# Altium schematic sheet RS485.SchDoc: RP2040 CNC
size B; Author: AM; CompanyName: Expatria Technologies; DrawnBy: A.Marles; Engineer: AM; Organization: Expatria Technolgoies; DocumentNumber: 6; SheetNumber: 6; SheetTotal: 14
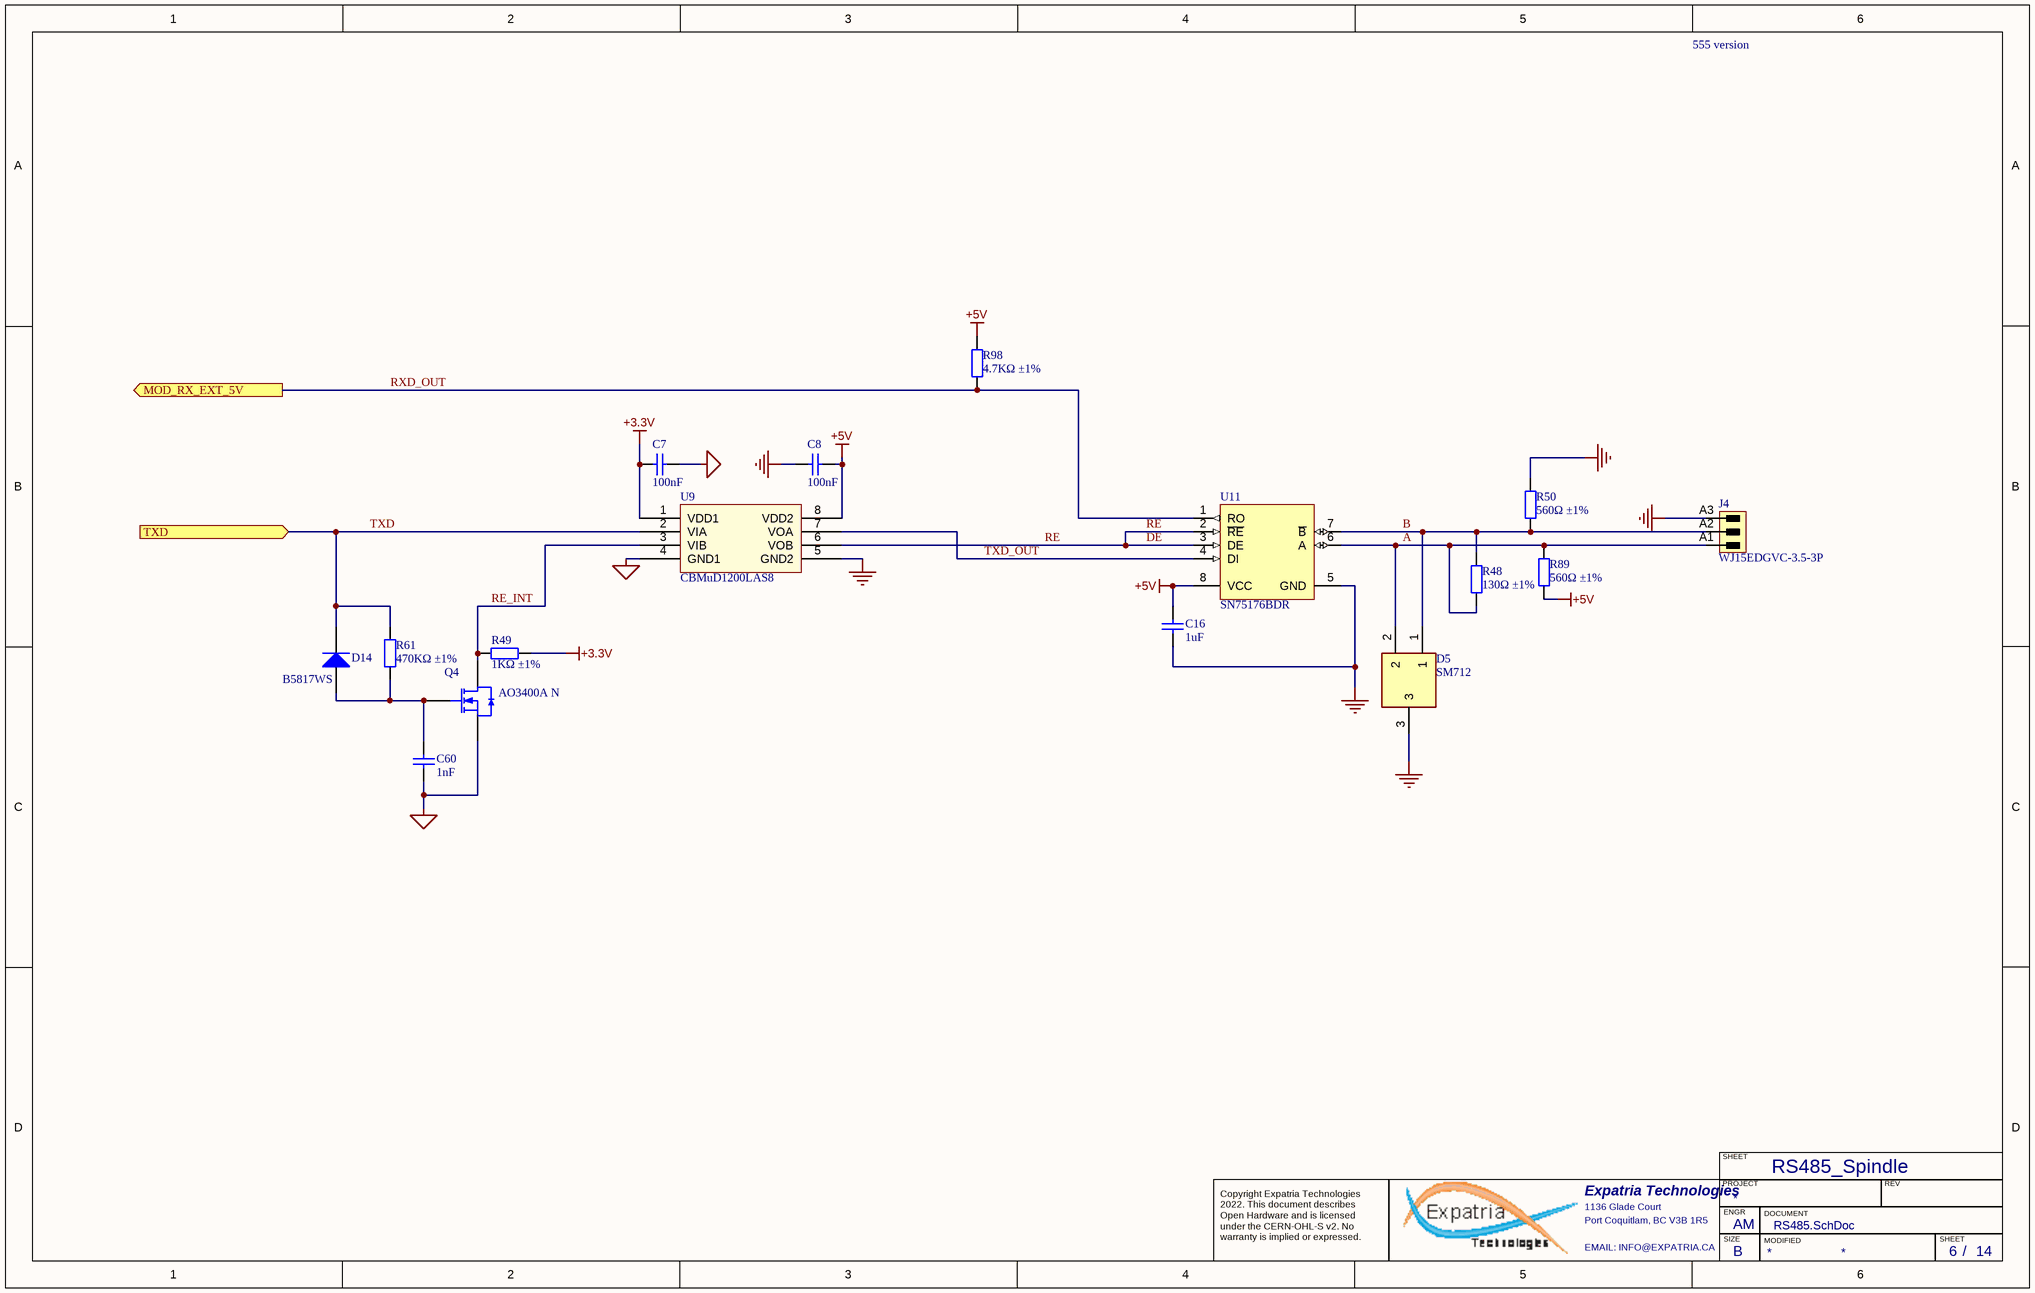
[diagram p0: RS485.SchDoc]

## Parts
C7  100nF  [0603_C]
C8  100nF  [0603_C]
C16  1uF  [0603_C]
C60  1nF  [0603_C]
D5  SM712  [SOT95P230X117-3N]
D14  B5817WS  [SOD-323]
J4  WJ15EDGVC-3.5-3P  [691321100003 - 3.5mm  3p]
Q4  AO3400A N  [SOT-23-3L]
R48  130Ω ±1%  [0603_R]
R49  1KΩ ±1%  [0603_R]
R50  560Ω ±1%  [0603_R]
R61  470KΩ ±1%  [0603_R]
R89  560Ω ±1%  [0603_R]
R98  4.7KΩ ±1%  [0603_R]
U9  CBMuD1200LAS8  [SOIC-8_150mil]
U11  SN75176BDR  [SOIC-8_150mil]

## Ports
MOD_RX_EXT_5V (out), TXD (in)

## Nets
+3.3V: C7.1 R49.1 U9.1(VDD1)
+5V: C8.2 C16.2 R89.2 R98.2 U9.8(VDD2) U11.8(VCC)
GND: C8.1 C16.1 D5.3 J4.A3 R50.1 U9.5(GND2) U11.5(GND)
MCU_GND: C7.2 C60.2 Q4.2(S) U9.4(GND1)
A: D5.2 J4.A1 R48.1 R89.1 U11.6(A)
B: D5.1 J4.A2 R48.2 R50.2 U11.7(~{B})
DE: U9.6(VOB) U11.2(~{RE}) U11.3(DE)  [also labelled RE]
RE_INT: Q4.3(D) R49.2 U9.3(VIB)
RXD_OUT: R98.1 U11.1(RO) ; port MOD_RX_EXT_5V
TXD: D14.2(K) R61.1 U9.2(VIA) ; port TXD
TXD_OUT: U9.7(VOA) U11.4(DI)
NetC60_1: C60.1 D14.1(A) Q4.1(G) R61.2

## Notes on the sheet
- 555 version
- RS485_Spindle
- SHEET
- Expatria Technologies
- 1136 Glade Court
- Port Coquitlam, BC V3B 1R5
- PROJECT
- SIZE
- ENGR
- MODIFIED
- DOCUMENT
- REV
- Copyright Expatria Technologies 2022. This document describes Open Hardware and is licensed under the CERN-OHL-S v2. No warranty is implied or expressed.
- EMAIL: INFO@EXPATRIA.CA
- B
- /

## Library data of the parts
C7 C8 = 0603 100nF (104) 10% 50V: Chip capacitors; Manufacturer: YAGEO; PartNumber: CC0603KRX7R9BB104; Tolerance: 10%; Voltage: 50V; ComponentLink1Description: Supplier link; ComponentLink1URL: http://www.szlcsc.com/product/details_15331.html; Package: 0603; Supplier: LC; SuppliersPartNumber: C14663; Capacitance: 100nF
C16 = 0603 1uF (105) 10% 50V: Chip capacitors; Manufacturer: Samsung Electro-Mechanics; PartNumber: CL10A105KB8NNNC; Tolerance: 10%; Voltage: 50V; ComponentLink1Description: Supplier link; ComponentLink1URL: http://www.szlcsc.com/product/details_16531.html; Package: 0603; Supplier: LC; SuppliersPartNumber: C15849; Capacitance: 1uF
C60 = 0603 1nF (102) 10% 50V: Chip capacitors; Manufacturer: Samsung Electro-Mechanics; PartNumber: CL10B102KB8NNNC; Tolerance: 10%; Voltage: 50V; ComponentLink1Description: Supplier link; ComponentLink1URL: http://www.szlcsc.com/product/details_1940.html; Package: 0603; Supplier: LC; SuppliersPartNumber: C1588; Capacitance: 1nF
D5 = CDSOT23-SM712: Bidirectional 12V (Max), 7V (Max) 7.5V / 13.3V 10V / 20V 12A(8/20us) SOT-23-3 TVS RoHS; Manufacturer_Name: DOWO; Height: 1.17mm; Manufacturer_Part_Number: SM712; SuppliersPartNumber: C293966
D14 = SOD-123 B5819W  SL: 20V 750mV@3A 1A SOD-323 Schottky Barrier Diodes (SBD) ROHS; Package: SOD-323; Supplier: LC; SuppliersPartNumber: C699102
J4 = 3.5mm Terminal Header 3p: Header,Male Pin,Covered(4 Sided) 3 1 0.138"（3.50mm） 3 P=3.5mm Pluggable System Terminal Block RoHS; Manufacturer: Ningbo Kangnex Elec; Pitch_mm: 3.5 mm; UL_94_flammability_rating: V-0; Side_termination_characteristic: closed side; Solder_pin_length_mm: 3.2 mm; Short_text_for_material: SL 3.50/03/180G 3.2SN OR BX; Pitch_inch: 0.138 inch; PartNumber: WJ15EDGVC-3.5-3P; PackageReference: SL_3_50_180G_03; ComponentLink1URL: http://www.weidmueller.com/; ComponentLink1Description: Manufacturer URL; Packaging: Box; Revision: V1; SuppliersPartNumber: C192778; Manufacturer 1: Ningbo Kangnex Elec; Manufacturer Part Number 1: WJ15EDGVC-3.5-3P; Package: P=3.5mm
Q4 = AO3400A N道沟 X0YV1T SOT-23: MOS(场效应管); ComponentLink1Description: 供应商链接; ComponentLink1URL: http://www.szlcsc.com/product/details_21629.html; Package: SOT-23; Supplier: LC; SuppliersPartNumber: C20917
R48 = 0603 130R (1300) 1%: Chip resistor; Manufacturer: Uniroyal Elec; PartNumber: 0603WAF1300T5E; Power: 1/10W; ComponentLink1Description: Supplier link; ComponentLink1URL: http://www.szlcsc.com/product/details_23523.html; Package: 0603; Supplier: LC; SuppliersPartNumber: C22796; Resistance: 130Ω; Tolerance: 1%
R49 = 0603 1K (1001) 1%: Chip resistor; Manufacturer: Uniroyal Elec; PartNumber: 0603WAF1001T5E; Power: 1/10W; ComponentLink1Description: Supplier link; ComponentLink1URL: http://www.szlcsc.com/product/details_21904.html; Package: 0603; Supplier: LC; SuppliersPartNumber: C21190; Resistance: 1KΩ; Tolerance: 1%
R50 R89 = 0603 560R (5600) 1%: Chip resistor; Manufacturer: Uniroyal Elec; PartNumber: 0603WAF5600T5E; Power: 1/10W; ComponentLink1Description: Supplier link; ComponentLink1URL: http://www.szlcsc.com/product/details_23931.html; Package: 0603; Supplier: LC; SuppliersPartNumber: C23204; Resistance: 560Ω; Tolerance: 1%
R61 = 0603 470K (4703) 1%: Chip resistor; Manufacturer: Uniroyal Elec; PartNumber: 0603WAF4703T5E; Power: 1/10W; ComponentLink1Description: Supplier link; ComponentLink1URL: http://www.szlcsc.com/product/details_23905.html; Package: 0603; Supplier: LC; SuppliersPartNumber: C23178; Resistance: 470KΩ; Tolerance: 1%
R98 = 0603 4.7K (4701) 1%: Chip resistor; Manufacturer: Uniroyal Elec; PartNumber: 0603WAF4701T5E; Power: 1/10W; ComponentLink1Description: Supplier link; ComponentLink1URL: http://www.szlcsc.com/product/details_23889.html; Package: 0603; Supplier: LC; SuppliersPartNumber: C23162; Resistance: 4.7KΩ; Tolerance: 1%
U9 = CBMuD1200LAS8: Dual Channel Isolator; Package: SOIC-8_150mil; Supplier: LC; SuppliersPartNumber: C476470; ComponentLink1Description: 供应商链接; ComponentLink1URL: http://www.szlcsc.com/product/details_10199.html
U11 = SN75176BDR_[C7063]: RS-485/RS-422; ComponentLink1Description: 供应商链接; ComponentLink1URL: http://www.szlcsc.com/product/details_7535.html; Package: SOIC-8_150mil; Supplier: LC; SuppliersPartNumber: C7063